# EAGLE design Artemis-Nano (EAGLE 9.4.0)

## Sheet 1 of 2
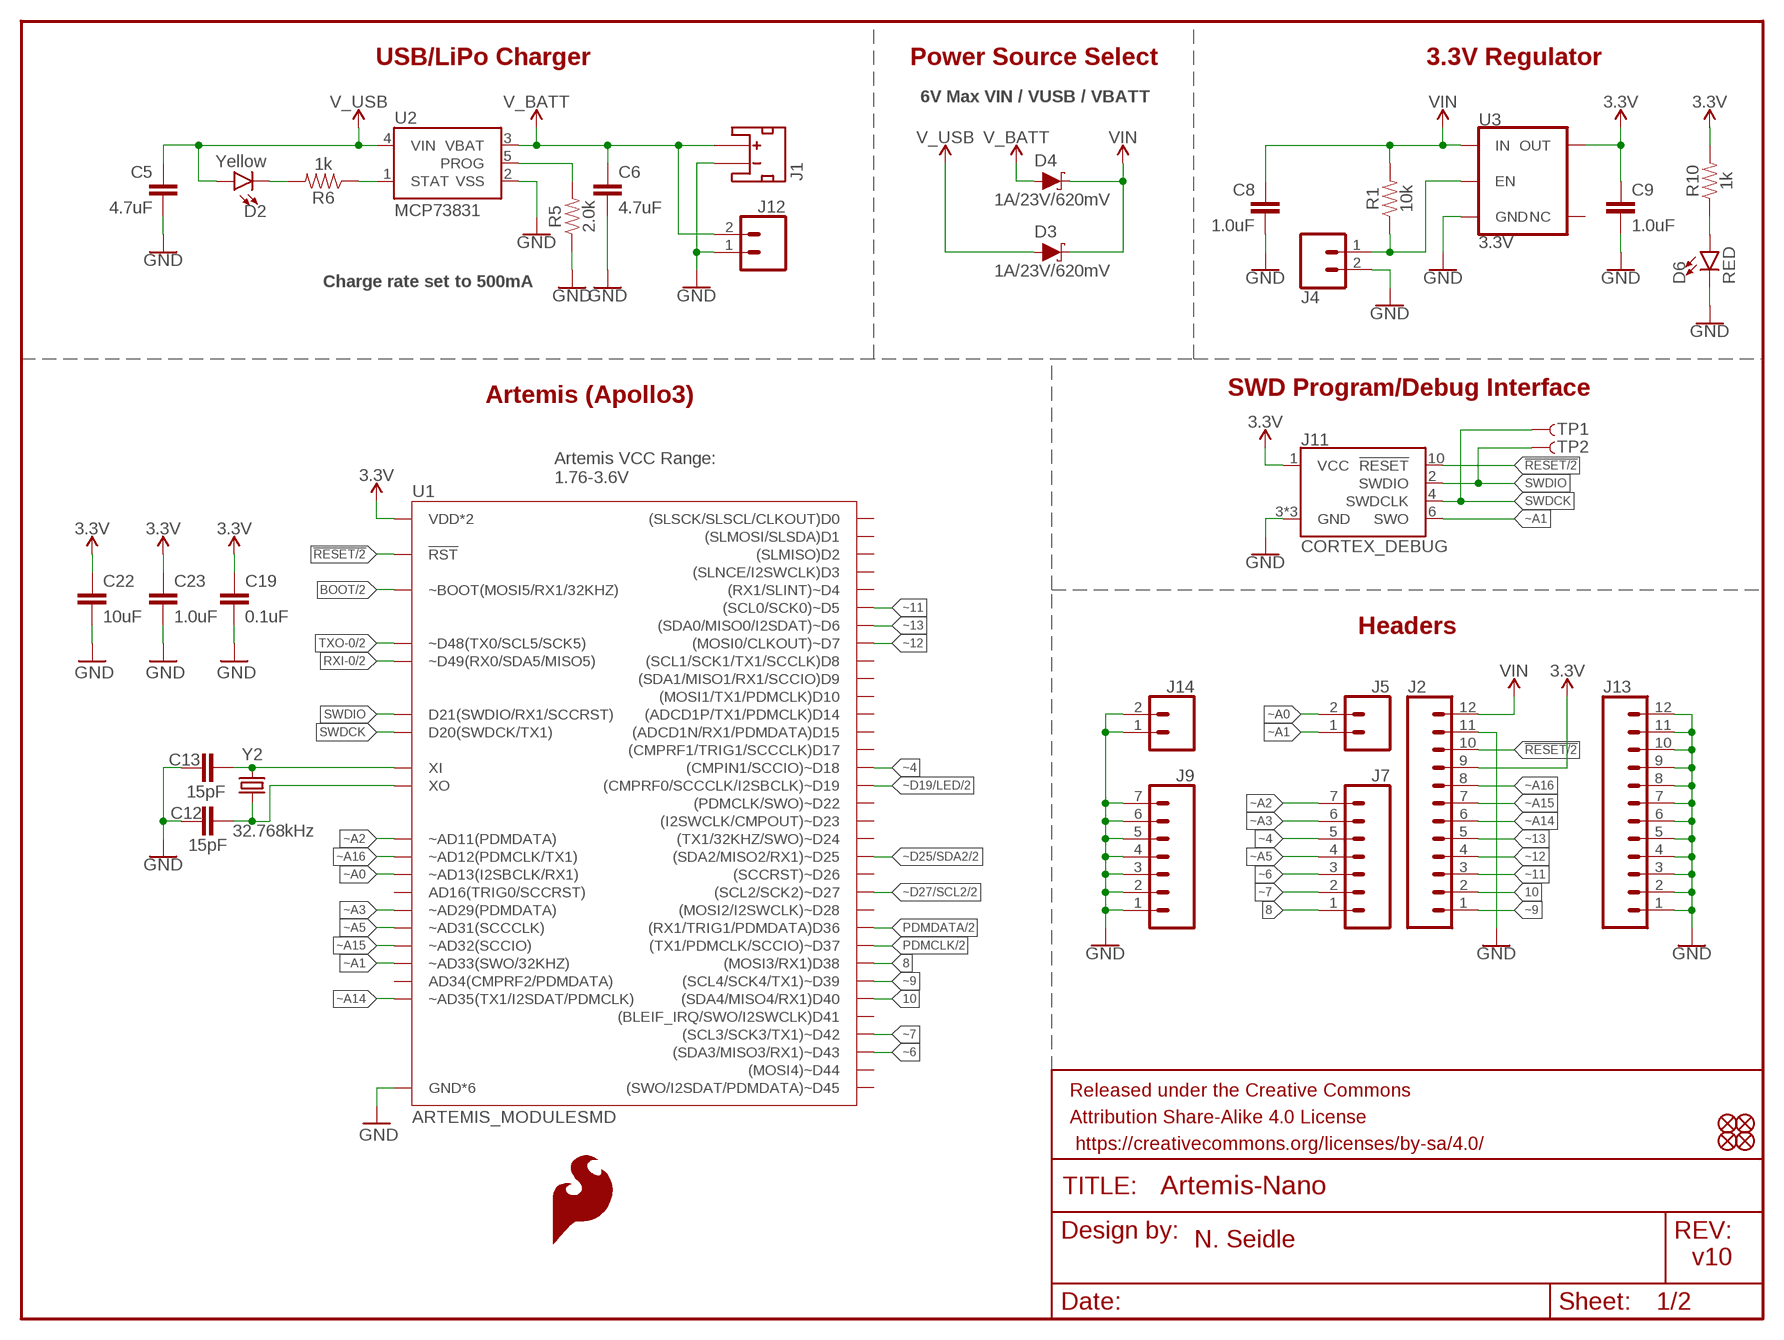
[diagram p0: schematic, sheet 1]

### Parts
C5  4.7uF  4.7UF-0603-6.3V-(10%)  [0603]
C6  4.7uF  4.7UF-0603-6.3V-(10%)  [0603]
C8  1.0uF  1.0UF-0402T-16V-10%  [0402-TIGHT]
C9  1.0uF  1.0UF-0402T-16V-10%  [0402-TIGHT]
C12  15pF  15PF-0603-50V-5%  [0603]
C13  15pF  15PF-0603-50V-5%  [0603]
C19  0.1uF  0.1UF-0402T-16V-10%  [0402-TIGHT]
C22  10uF  10UF-0603-6.3V-20%  [0603]
C23  1.0uF  1.0UF-0402T-16V-10%  [0402-TIGHT]
D2  Yellow  LED-YELLOW0603  [LED-0603]
D3  1A/23V/620mV  DIODE-SCHOTTKY-BAT20J  [SOD-323]
D4  1A/23V/620mV  DIODE-SCHOTTKY-BAT20J  [SOD-323]
D6  RED  LED-RED0603  [LED-0603]
FD1  FIDUCIALUFIDUCIAL  [FIDUCIAL-MICRO]
FD2  FIDUCIALUFIDUCIAL  [FIDUCIAL-MICRO]
FD3  FIDUCIALUFIDUCIAL  [FIDUCIAL-MICRO]
FD4  FIDUCIALUFIDUCIAL  [FIDUCIAL-MICRO]
FRAME1  FRAME-LETTER  [CREATIVE_COMMONS]
J1  JST_2MM_MALE  [JST-2-SMD]
J2  CONN_12NO_SILK  [1X12_NO_SILK]
J4  CONN_021X02_NO_SILK  [1X02_NO_SILK]
J5  CONN_021X02_NO_SILK  [1X02_NO_SILK]
J7  CONN_07NO_SILK  [1X07_NO_SILK]
J9  CONN_07NO_SILK  [1X07_NO_SILK]
J11  CORTEX_DEBUG  CORTEX_DEBUG_MINIMUM_PTH_NS  [2X5-PTH-1.27MM-NO_SILK]
J12  CONN_021X02_NO_SILK  [1X02_NO_SILK]
J13  CONN_12NO_SILK  [1X12_NO_SILK]
J14  CONN_021X02_NO_SILK  [1X02_NO_SILK]
LOGO1  SFE_LOGO_FLAME.1_INCH  [SFE_LOGO_FLAME_.1]
LOGO4  SFE_LOGO_FLAME.1_INCH  [SFE_LOGO_FLAME_.1]
R1  10k  10KOHM-0603-1/10W-1%  [0603]
R5  2.0k  2.0KOHM-0603-1/10W-5%  [0603]
R6  1k  1KOHM-0603-1/10W-1%  [0603]
R10  1k  1KOHM-0603-1/10W-1%  [0603]
TP1  TEST-POINT3X5  [PAD.03X.05]
TP2  TEST-POINT3X5  [PAD.03X.05]
U1  ARTEMIS_MODULESMD  [ARTEMIS_FP]
U2  MCP73831  [SOT23-5]
U3  3.3V  V_REG_AP2112K-3.3V  [SOT23-5]
Y2  32.768kHz  CRYSTAL-32.768KHZSMD-3.2X1.5  [CRYSTAL-SMD-3.2X1.5MM]

### Nets
3.3V: C9.1 C19.2 C22.1 C23.1 J2.9 J11.1(VCC) R10.2 U1.VDD@36(VDD*2) U1.VDD@37(VDD*2) U3.5(OUT) ; also sheet 2
8: J7.1 U1.D38((MOSI3/RX1)D38)
10: J2.2 U1.D40((SDA4/MISO4/RX1)D40)
!RESET: J2.10 J11.10(!RESET) U1.~RST(!RST) ; also sheet 2
BOOT: U1.BOOT(~BOOT(MOSI5/RX1/32KHZ)) ; also sheet 2
GND: C5.2 C6.2 C8.2 C9.2 C12.1 C13.1 C19.1 C22.2 C23.2 D6.C J1.1(-) J2.11 J4.2 J9.1 J9.2 J9.3 J9.4 J9.5 J9.6 J9.7 J11.3(GND) J11.5(GND) J11.9(GND) J12.1 J13.1 J13.2 J13.3 J13.4 J13.5 J13.6 J13.7 J13.8 J13.9 J13.10 J13.11 J13.12 J14.1 J14.2 R5.1 U1.GND@1(GND*6) U1.GND@22(GND*6) U1.GND@38(GND*6) U1.GND@39(GND*6) U1.GND@47(GND*6) U1.GND@59(GND*6) U2.2(VSS) U3.2(GND) ; also sheet 2
N$1: R5.2 U2.5(PROG)
N$2: C12.2 U1.XO Y2.P$2
N$3: D2.C R6.2
N$4: R6.1 U2.1(STAT)
N$8: C13.2 U1.XI Y2.P$1
N$10: D6.A R10.1
PDMCLK: U1.~D37((TX1/PDMCLK/SCCIO)~D37) ; also sheet 2
PDMDATA: U1.D36((RX1/TRIG1/PDMDATA)D36) ; also sheet 2
RXI-0: U1.RXI-0(~D49(RX0/SDA5/MISO5)) ; also sheet 2
SWDCK: J11.4(SWDCLK) TP1.P$1 U1.SWDCK(D20(SWDCK/TX1))
SWDIO: J11.2(SWDIO) TP2.P$1 U1.SWDIO(D21(SWDIO/RX1/SCCRST))
TXO-0: U1.TXO-0(~D48(TX0/SCL5/SCK5)) ; also sheet 2
V_BATT [power]: C6.1 D4.A J1.2(+) J12.2 U2.3(VBAT)
V_USB: C5.1 D2.A D3.A U2.4(VIN) ; also sheet 2
VIN: C8.1 D3.C D4.C J2.12 R1.2 U3.1(IN)
VREG_EN: J4.1 R1.1 U3.3(EN)
~4: J7.5 U1.~D18((CMPIN1/SCCIO)~D18)
~6: J7.3 U1.~D43((SDA3/MISO3/RX1)~D43)
~7: J7.2 U1.~D42((SCL3/SCK3/TX1)~D42)
~9: J2.1 U1.~D39((SCL4/SCK4/TX1)~D39)
~11: J2.3 U1.~D5((SCL0/SCK0)~D5)
~12: J2.4 U1.D7((MOSI0/CLKOUT)~D7)
~13: J2.5 U1.~D6((SDA0/MISO0/I2SDAT)~D6)
~A0: J5.2 U1.~AD13(~AD13(I2SBCLK/RX1))
~A1: J5.1 J11.6(SWO) U1.~AD33/SWO(~AD33(SWO/32KHZ))
~A2: J7.7 U1.~AD11(~AD11(PDMDATA))
~A3: J7.6 U1.~AD29(~AD29(PDMDATA))
~A5: J7.4 U1.~AD31(~AD31(SCCCLK))
~A14: J2.6 U1.~AD35(~AD35(TX1/I2SDAT/PDMCLK))
~A15: J2.7 U1.~AD32(~AD32(SCCIO))
~A16: J2.8 U1.~AD12(~AD12(PDMCLK/TX1))
~D19/LED: U1.~D19((CMPRF0/SCCCLK/I2SBCLK)~D19) ; also sheet 2
~D25/SDA2: U1.~D25((SDA2/MISO2/RX1)~D25) ; also sheet 2
~D27/SCL2: U1.~D27((SCL2/SCK2)~D27) ; also sheet 2
Unconnected: J1.NC1(PAD1) J1.NC2(PAD2) U1.AD16(AD16(TRIG0/SCCRST)) U1.AD34(AD34(CMPRF2/PDMDATA)) U1.D0((SLSCK/SLSCL/CLKOUT)D0) U1.D1((SLMOSI/SLSDA)D1) U1.D2((SLMISO)D2) U1.D3((SLNCE/I2SWCLK)D3) U1.D8((SCL1/SCK1/TX1/SCCLK)D8) U1.D9((SDA1/MISO1/RX1/SCCIO)D9) U1.D10((MOSI1/TX1/PDMCLK)D10) U1.D14((ADCD1P/TX1/PDMCLK)D14) U1.D15((ADCD1N/RX1/PDMDATA)D15) U1.D17((CMPRF1/TRIG1/SCCCLK)D17) U1.D41((BLEIF_IRQ/SWO/I2SWCLK)D41) U1.~D4((RX1/SLINT)~D4) U1.~D22((PDMCLK/SWO)~D22) U1.~D23((I2SWCLK/CMPOUT)~D23) U1.~D24((TX1/32KHZ/SWO)~D24) U1.~D26((SCCRST)~D26) U1.~D28((MOSI2/I2SWCLK)~D28) U1.~D44((MOSI4)~D44) U1.~D45((SWO/I2SDAT/PDMDATA)~D45) U3.4(NC)

### Notes on the sheet
- USB/LiPo Charger | Power Source Select | 3.3V Regulator
- 6V Max VIN / VUSB / VBATT
- Charge rate set to 500mA
- Artemis (Apollo3) | SWD Program/Debug Interface
- Artemis VCC Range:
  1.76-3.6V
- Headers
- N. Seidle
- v10

## Sheet 2 of 2
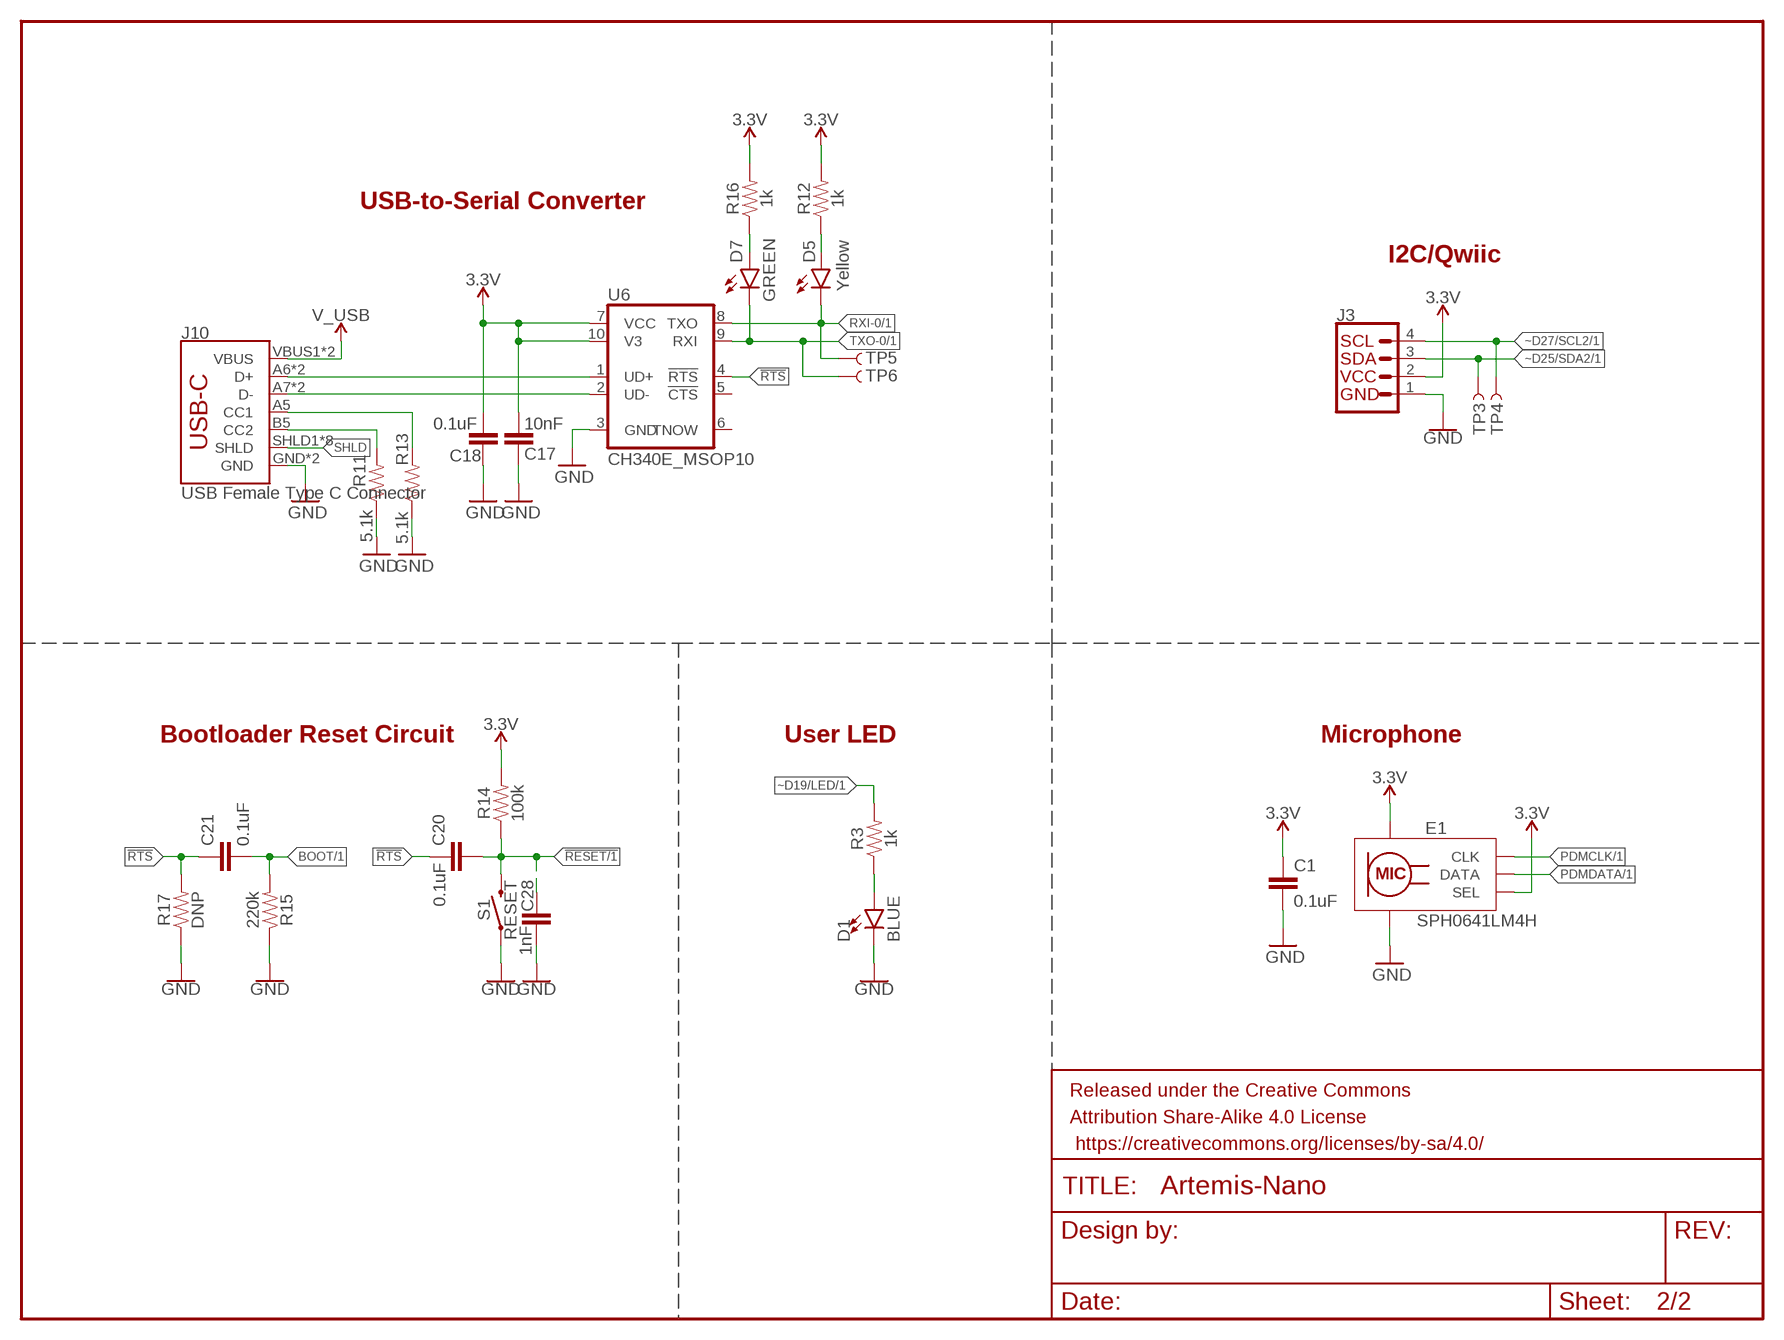
[diagram p1: schematic, sheet 2]

### Parts
C1  0.1uF  0.1UF-0402T-16V-10%  [0402-TIGHT]
C17  10nF  10NF-0603-50V-10%  [0603]
C18  0.1uF  0.1UF-0603-25V-(+80/-20%)  [0603]
C20  0.1uF  0.1UF-0603-25V-5%  [0603]
C21  0.1uF  0.1UF-0603-25V-5%  [0603]
C28  1nF  1.0NF/1000PF-0603-50V-10%  [0603]
D1  BLUE  LED-BLUE0603  [LED-0603]
D5  Yellow  LED-YELLOW0603  [LED-0603]
D7  GREEN  LED-GREEN0603  [LED-0603]
E1  SPH0641LM4H  SPH0641LM4H-1_MICROPHONE  [SPH0641LM4H-1_MICROPHONE]
FRAME2  FRAME-LETTERNO_PACKAGE  [DUMMY]
J3  QWIIC_CONNECTORJS-1MM  [JST04_1MM_RA]
J10  USB Female Type C Connector  USB_C4-LAYER-ISOLATED  [USB-C-16P-4LAYER-ISOLATED]
R3  1k  1KOHM-0603-1/10W-1%  [0603]
R11  5.1k  5.1KOHM5.1KOHM-0603-1/10W-1%  [0603]
R12  1k  1KOHM-0603-1/10W-1%  [0603]
R13  5.1k  5.1KOHM5.1KOHM-0603-1/10W-1%  [0603]
R14  100k  100KOHM-0603-1/10W-1%  [0603]
R15  220k  220KOHM-0603-1/10W-1%  [0603]
R16  1k  1KOHM-0603-1/10W-1%  [0603]
R17  DNP  RESISTOR0603  [0603]
S1  RESET  MOMENTARY-SWITCH-SPST-SMD-4.6X2.8MM  [TACTILE_SWITCH_SMD_4.6X2.8MM]
TP3  TEST-POINT3X5  [PAD.03X.05]
TP4  TEST-POINT3X5  [PAD.03X.05]
TP5  TEST-POINT3X5  [PAD.03X.05]
TP6  TEST-POINT3X5  [PAD.03X.05]
U6  CH340E_MSOP10  [MSOP10]

### Nets
3.3V: C1.1 C17.1 C18.1 E1.2(SEL) E1.5(VDD) J3.2 R12.2 R14.2 R16.2 U6.7(VCC) U6.10(V3) ; also sheet 1
!RESET: C20.2 C28.1 R14.1 S1.3 S1.4 ; also sheet 1
!RTS: C20.1 C21.1 R17.2 U6.4(!RTS)
BOOT: C21.2 R15.2 ; also sheet 1
CC1: J10.A5(CC1) R13.2
CC2: J10.B5(CC2) R11.2
D+1: J10.A6(D+) J10.B6(D+) U6.1(UD+)
D-1: J10.A7(D-) J10.B7(D-) U6.2(UD-)
GND: C1.2 C17.2 C18.2 C28.2 D1.C E1.3(GND) E1.6(GND) E1.7(GND) E1.8(GND) J3.1 J10.GND J10.GND2(GND) R11.1 R13.1 R15.1 R17.1 S1.1 S1.2 U6.3(GND) ; also sheet 1
N$5: D7.A R16.1
N$7: D1.A R3.1
N$9: D5.A R12.1
PDMCLK: E1.4(CLK) ; also sheet 1
PDMDATA: E1.1(DATA) ; also sheet 1
RXI-0: D5.C TP5.P$1 U6.8(TXO) ; also sheet 1
SHLD: J10.SHLD1(SHLD) J10.SHLD2(SHLD) J10.SHLD3(SHLD) J10.SHLD4(SHLD) J10.SHLD5(SHLD) J10.SHLD6(SHLD) J10.SHLD7(SHLD) J10.SHLD8(SHLD)
TXO-0: D7.C TP6.P$1 U6.9(RXI) ; also sheet 1
V_USB: J10.VBUS1(VBUS) J10.VBUS2(VBUS) ; also sheet 1
~D19/LED: R3.2 ; also sheet 1
~D25/SDA2: J3.3 TP3.P$1 ; also sheet 1
~D27/SCL2: J3.4 TP4.P$1 ; also sheet 1
Unconnected: U6.5(!CTS) U6.6(TNOW)

### Notes on the sheet
- USB-to-Serial Converter
- I2C/Qwiic
- Bootloader Reset Circuit | User LED | Microphone

## Library data of the parts
C1 C19 = SparkFun-Capacitors:0.1UF: 0.1µF ceramic capacitors A capacitor is a passive two-terminal electrical component used to store electrical energy temporarily in an electric field.; PROD_ID: CAP-12416
C5 C6 = SparkFun-Capacitors:4.7UF: 4.7µF ceramic capacitors A capacitor is a passive two-terminal electrical component used to store electrical energy temporarily in an electric field.; PROD_ID: CAP-08280
C8 C9 C23 = SparkFun-Capacitors:1.0UF: 1µF ceramic capacitors A capacitor is a passive two-terminal electrical component used to store electrical energy temporarily in an electric field.; PROD_ID: CAP-12417
C12 C13 = SparkFun-Capacitors:15PF: 15pF ceramic capacitors A capacitor is a passive two-terminal electrical component used to store electrical energy temporarily in an electric field.; PROD_ID: CAP-07881
C17 = SparkFun-Capacitors:10NF: 0.01uF/10nF/10,000pF ceramic capacitors A capacitor is a passive two-terminal electrical component used to store electrical energy temporarily in an electric field. CAP-09321; PROD_ID: CAP-00867
C18 = SparkFun-Capacitors:0.1UF: 0.1µF ceramic capacitors A capacitor is a passive two-terminal electrical component used to store electrical energy temporarily in an electric field.; PROD_ID: CAP-00810
C20 C21 = SparkFun-Capacitors:0.1UF: 0.1µF ceramic capacitors A capacitor is a passive two-terminal electrical component used to store electrical energy temporarily in an electric field.; PROD_ID: CAP-08604
C22 = SparkFun-Capacitors:10UF: 10.0µF ceramic capacitors A capacitor is a passive two-terminal electrical component used to store electrical energy temporarily in an electric field.; PROD_ID: CAP-11015
C28 = SparkFun-Capacitors:1.0NF/1000PF: 1nF/1,000pF ceramic capacitors A capacitor is a passive two-terminal electrical component used to store electrical energy temporarily in an electric field.; PROD_ID: CAP-07886
D1 = SparkFun-LED:LED-BLUE: Blue SMD LED Used in manufacturing of various products at SparkFun Packages: 0603 - SMD 0603 package [Product Link] <http://www.digikey.com/product-detail/en/SMLE12BC7TT86/511-1589-2-ND/1641808> 1206 - SMD1206 package [Product Link] <http://www.digikey.com/product-detail/en/lite-on-inc/LTST-C150TBKT/160-1643-1-ND/573584> SparkFun Products: ESP8266 Thing-Dev Board <https://www.sparkfun.com/products/13711> RedBoard <https://www.sparkfun.com/products/12757>; PROD_ID: DIO-08575
D2 D5 = SparkFun-LED:LED-YELLOW: Yellow SMD LED Used in manufacturing several products at SparkFun. Packages: 0603 - SMD 0603 package[Product Link] <http://www.kingbrightusa.com/product.asp?catalog_name=LED&product_id=APT1608SYCK> 0603 -SMART - SMART SMD 0603 package (more efficient/more expensive) [Product Link] <http://www.osram-os.com/osram_os/en/products/product-catalog/led-light-emitting-diodes/smartled-0603/ly-l29k/index.jsp> LilyPad - SMD1206 package[Product Datasheet] <https://www.sparkfun.com/datasheets/DevTools/LilyPad/Q150YUS4.pdf> SparkFun Products: Blynk Board <https://www.sparkfun.com/products/13794> IOIO-OTG <https://www.sparkfun.com/products/13613> XBee Explorer Serial <https://www.sparkfun.com/products/13225>; PROD_ID: DIO-09003
D3 D4 = SparkFun-DiscreteSemi:DIODE-SCHOTTKY: Schottky diode A Schottky diode is a semiconductor diode which has a low forward voltage drop and a very fast switching action.; PROD_ID: DIO-11623
D6 = SparkFun-LED:LED-RED: Red SMD LED Used in manufacturing of most products at SparkFun Packages: 0603 - SMD 0603 package [Product Link] <http://docs.avagotech.com/docs/AV02-0551EN> 0603 SMART - SMD 0603 SMART package ( more efficient and expensive)[Product Link] <http://www.osram-os.com/Graphics/XPic2/00077099_0.pdf> 1206 - SMD1206 package [Product Link] <https://www.sparkfun.com/datasheets/DevTools/LilyPad/Q150OVS4.pdff> SparkFun Products: Pro Mini 328 -5V <https://www.sparkfun.com/products/821> RedBoard <https://www.sparkfun.com/products/12757> IOIO-OTG <https://www.sparkfun.com/products/13613>; PROD_ID: DIO-00819
D7 = SparkFun-LED:LED-GREEN: Green SMD LED Used in manufacturing of various products at SparkFun Packages: 0603 - SMD 0603 package [Product Link] <http://www.futureelectronics.com/en/technologies/semiconductors/optoelectronics/leds/Pages/9894312-LTST-C190GKT.aspx?CrossPart=HSMG-C190&IM=0> LilyPad 1206 - SMD1206 LilyPad package [Product Link] <http://www.futureelectronics.com/en/Technologies/Product.aspx?ProductID=IN150NGHARVATEKCORPORATION2049943&IM=0> 1206 - SMD1206 package [Product Link] <http://www.futureelectronics.com/en/technologies/semiconductors/optoelectronics/leds/Pages/8315665-LTST-C150KGKT.aspx?IM=0> 1206 Bottom Mount -SMD 1206 Bottom Mount [Product Link] <http://www.digikey.com/product-detail/en/lite-on-inc/LTST-C230KGKT/160-1456-1-ND/386854> SparkFun Products: Pro Mini 328 -5V <https://www.sparkfun.com/products/821> RedBoard <https://www.sparkfun.com/products/12757> MP3 Trigger <https://www.sparkfun.com/products/13720> Makey Makey <https://www.sparkfun.com/products/11076>; PROD_ID: DIO-00821
E1 = SparkFun-Sensors:SPH0641LM4H-1_MICROPHONE: SPH0641LM4H-1 Microphone A miniature, high-performance, low power, bottom port silicon digital microphone with a single bit PDM output.; PROD_ID: IC-14361; VALUE: SPH0641LM4H-1
FD1-FD4 = SparkFun-Aesthetics:FIDUCIAL: Fiducial Alignment Points Point-of-reference for pick-and-place machines and other optical instruments.
FRAME1 = SparkFun-Aesthetics:FRAME-LETTER: Schematic Frame - Letter Standard 8.5x11 US Letter frame
FRAME2 = SparkFun-Aesthetics:FRAME-LETTER: Schematic Frame - Letter Standard 8.5x11 US Letter frame; DESIGNER: Nobody; VERSION: v01
J1 = SparkFun-Connectors:JST_2MM_MALE: JST 2MM MALE RA CONNECTOR Two pin, compact surface mount connector. Commonly used as a battery input connection point. We really like the solid locking feeling and high current rating on these small connectors. We use these all the time as battery connectors. Mates to single-cell LiPo batteries. Here is the connector we sell at SparkFun: JST Right Angle Connector - White <https://www.sparkfun.com/products/8612> (PRT-08612) Datasheet <http://www.sparkfun.com/datasheets/Prototyping/Connectors/JST-Horizontal.pdf> It was used on these SparkFun products: SparkFun MOSFET Power Controller <https://www.sparkfun.com/products/11214> (PRT-11214) SparkFun Battery Babysitter - LiPo Battery Manager <https://www.sparkfun.com/products/13777> (PRT-13777) And many, many others that required a lipo battery connection.; PROD_ID: CONN-11443; SF_ID: PRT-08612
J2 J13 = SparkFun-Connectors:CONN_12: Multi connection point. Often used as Generic Header-pin footprint for 0.1 inch spaced/style header connections On any of the 0.1 inch spaced packages, you can populate with these: Break Away Headers - Straight <https://www.sparkfun.com/products/116> (PRT-00116) Break Away Male Headers - Right Angle <https://www.sparkfun.com/products/553> (PRT-00553) Female Headers <https://www.sparkfun.com/products/115> (PRT-00115) Break Away Headers - Machine Pin <https://www.sparkfun.com/products/117> (PRT-00117) Break Away Female Headers - Swiss Machine Pin <https://www.sparkfun.com/products/743> (PRT-00743) For SCREWTERMINALS and SPRING TERMINALS visit here: Screw Terimnals on SparkFun.com <https://www.sparkfun.com/search/results?term=Screw+Terminals> (5mm/3.5mm/2.54mm spacing) This device is also useful as a general connection point to wire up your design to another part of your project. Our various solder wires solder well into these plated through hole pads. Hook-Up Wire - Assortment (Stranded, 22 AWG) <https://www.sparkfun.com/products/11375> (PRT-11375) Hook-Up Wire - Assortment (Solid Core, 22 AWG) <https://www.sparkfun.com/products/11367> (PRT-11367) View the entire wire category on our website here <https://www.sparkfun.com/categories/141> Special notes: Molex polarized connector foot print use with SKU : PRT-08231 with associated crimp pins and housings. 1MM SMD Version SKU: PRT-10208 NOTES ON THE VARIANTS LOCK and LOCK_LONGPADS... This footprint was designed to help hold the alignment of a through-hole component (i.e. 6-pin header) while soldering it into place. You may notice that each hole has been shifted either up or down by 0.005 of an inch from it's more standard position (which is a perfectly straight line). This slight alteration caused the pins (the squares in the middle) to touch the edges of the holes. Because they are alternating, it causes a "brace" to hold the component in place. 0.005 has proven to be the perfect amount of "off-center" position when using our standard breakaway headers. Although looks a little odd when you look at the bare footprint, once you have a header in there, the alteration is very hard to notice. Also,if you push a header all the way into place, it is covered up entirely on the bottom side.
J3 = SparkFun-Connectors:QWIIC_CONNECTOR: SparkFun I2C Standard Qwiic Connector An SMD 1mm pitch JST connector makes it easy and quick (get it? Qwiic?) to connect I2C devices to each other. The Qwiic system <http://www.sparkfun.com/qwiic> enables fast and solderless connection between popular platforms and various sensors and actuators. We carry 200mm <https://www.sparkfun.com/products/14204>, 100mm <https://www.sparkfun.com/products/14205>, 50mm <https://www.sparkfun.com/products/14206>, and breadboard friendly <https://www.sparkfun.com/products/14207> Qwiic cables. We also offer 10 pcs strips <https://www.sparkfun.com/products/14323> the SMD connectors.; PROD_ID: CONN-13694
J4 J5 J12 J14 = SparkFun-Connectors:CONN_02: Multi connection point. Often used as Generic Header-pin footprint for 0.1 inch spaced/style header connections On any of the 0.1 inch spaced packages, you can populate with these: Break Away Headers - Straight <https://www.sparkfun.com/products/116> (PRT-00116) Break Away Male Headers - Right Angle <https://www.sparkfun.com/products/553> (PRT-00553) Female Headers <https://www.sparkfun.com/products/115> (PRT-00115) Break Away Headers - Machine Pin <https://www.sparkfun.com/products/117> (PRT-00117) Break Away Female Headers - Swiss Machine Pin <https://www.sparkfun.com/products/743> (PRT-00743) For SCREWTERMINALS and SPRING TERMINALS visit here: Screw Terimnals on SparkFun.com <https://www.sparkfun.com/search/results?term=Screw+Terminals> (5mm/3.5mm/2.54mm spacing) This device is also useful as a general connection point to wire up your design to another part of your project. Our various solder wires solder well into these plated through hole pads. Hook-Up Wire - Assortment (Stranded, 22 AWG) <https://www.sparkfun.com/products/11375> (PRT-11375) Hook-Up Wire - Assortment (Solid Core, 22 AWG) <https://www.sparkfun.com/products/11367> (PRT-11367) View the entire wire category on our website here <https://www.sparkfun.com/categories/141> Special notes: Molex polarized connector foot print use with: PRT-08233 with associated crimp pins and housings. 2.54_SCREWTERM for use with PRT-10571. 3.5mm Screw Terminal footprints for PRT-08084 5mm Screw Terminal footprints for use with PRT-08432
J7 J9 = SparkFun-Connectors:CONN_07: Multi connection point. Often used as Generic Header-pin footprint for 0.1 inch spaced/style header connections On any of the 0.1 inch spaced packages, you can populate with these: Break Away Headers - Straight <https://www.sparkfun.com/products/116> (PRT-00116) Break Away Male Headers - Right Angle <https://www.sparkfun.com/products/553> (PRT-00553) Female Headers <https://www.sparkfun.com/products/115> (PRT-00115) Break Away Headers - Machine Pin <https://www.sparkfun.com/products/117> (PRT-00117) Break Away Female Headers - Swiss Machine Pin <https://www.sparkfun.com/products/743> (PRT-00743) For SCREWTERMINALS and SPRING TERMINALS visit here: Screw Terimnals on SparkFun.com <https://www.sparkfun.com/search/results?term=Screw+Terminals> (5mm/3.5mm/2.54mm spacing) This device is also useful as a general connection point to wire up your design to another part of your project. Our various solder wires solder well into these plated through hole pads. Hook-Up Wire - Assortment (Stranded, 22 AWG) <https://www.sparkfun.com/products/11375> (PRT-11375) Hook-Up Wire - Assortment (Solid Core, 22 AWG) <https://www.sparkfun.com/products/11367> (PRT-11367) View the entire wire category on our website here <https://www.sparkfun.com/categories/141> Special notes: Molex polarized connector foot print use with SKU : PRT-08231 with associated crimp pins and housings. 1MM SMD Version SKU: PRT-10208 NOTES ON THE VARIANTS LOCK and LOCK_LONGPADS... This footprint was designed to help hold the alignment of a through-hole component (i.e. 6-pin header) while soldering it into place. You may notice that each hole has been shifted either up or down by 0.005 of an inch from it's more standard position (which is a perfectly straight line). This slight alteration caused the pins (the squares in the middle) to touch the edges of the holes. Because they are alternating, it causes a "brace" to hold the component in place. 0.005 has proven to be the perfect amount of "off-center" position when using our standard breakaway headers. Although looks a little odd when you look at the bare footprint, once you have a header in there, the alteration is very hard to notice. Also,if you push a header all the way into place, it is covered up entirely on the bottom side.
J10 = SparkFun-Connectors:USB_C: USB Type C 16Pin Connector Super Speed pins not available on the 16-pin purely SMD connector so this part is best for USB 2.0 implementations. D1 and D2 are tied together enabling D+/- no matter which way the cable is plugged into the connector. The two channel configuration pins (CC1/2) are exposed. These are normally connected to ground via 5.1k resistors but can be reconfigured for high current/high power applications.; PROD_ID: CONN-14122
J11 = SparkFun-Connectors:CORTEX_DEBUG_MINIMUM: Cortex Debug Connector - 10 pin Supports JTAG debug, Serial Wire debug, and Serial Wire Viewer. PTH and SMD connector options available. General Connector Information <http://infocenter.arm.com/help/topic/com.arm.doc.faqs/attached/13634/cortex_debug_connectors.pdf> Products: PTH Connector <http://www.digikey.com/product-detail/en/cnc-tech/3220-10-0100-00/1175-1627-ND/3883661> -via Digi-Key SparkFun PSoc <https://www.sparkfun.com/products/13229> SparkFun T <https://www.sparkfun.com/products/13810>
LOGO1 LOGO4 = SparkFun-Aesthetics:SFE_LOGO_FLAME: SparkFun Flame Logo This is the SparkFun flame logo. The logo on the schematic will always be the same size; the package variant is the height of the flame. Default layer for the logo on the board is tSilk.
R1 = SparkFun-Resistors:10KOHM: 10kΩ resistor A resistor is a passive two-terminal electrical component that implements electrical resistance as a circuit element. Resistors act to reduce current flow, and, at the same time, act to lower voltage levels within circuits. - Wikipedia; PROD_ID: RES-00824
R3 R6 R10 R12 R16 = SparkFun-Resistors:1KOHM: 1kΩ resistor A resistor is a passive two-terminal electrical component that implements electrical resistance as a circuit element. Resistors act to reduce current flow, and, at the same time, act to lower voltage levels within circuits. - Wikipedia; PROD_ID: RES-07856
R5 = SparkFun-Resistors:2.0KOHM: 2kΩ resistor A resistor is a passive two-terminal electrical component that implements electrical resistance as a circuit element. Resistors act to reduce current flow, and, at the same time, act to lower voltage levels within circuits. - Wikipedia; PROD_ID: RES-08296
R11 R13 = SparkFun-Resistors:5.1KOHM; PROD_ID: RES-12083
R14 = SparkFun-Resistors:100KOHM: 100kΩ resistor A resistor is a passive two-terminal electrical component that implements electrical resistance as a circuit element. Resistors act to reduce current flow, and, at the same time, act to lower voltage levels within circuits. - Wikipedia; PROD_ID: RES-07828
R15 = SparkFun-Resistors:220KOHM: 220kΩ resistor A resistor is a passive two-terminal electrical component that implements electrical resistance as a circuit element. Resistors act to reduce current flow, and, at the same time, act to lower voltage levels within circuits. - Wikipedia; PROD_ID: RES-08969
R17 = SparkFun-Resistors:RESISTOR: Generic Resistor Package
S1 = SparkFun-Switches:MOMENTARY-SWITCH-SPST: Momentary Switch (Pushbutton) - SPST Normally-open (NO) SPST momentary switches (buttons, pushbuttons). Variants PTH-12MM - 12mm square, through-hole Momentary Pushbutton Switch - 12mm Square <https://www.sparkfun.com/products/9190> (COM-09190) PTH-6.0MM, PTH-6.0MM-KIT - 6.0mm square, through-hole Mini Pushbutton Switch <https://www.sparkfun.com/products/97> (COM-00097) KIT package intended for soldering kit's - only one side of pads' copper is exposed. PTH-RIGHT-ANGLE-KIT - Right-angle, through-hole Right Angle Tactile Button <https://www.sparkfun.com/products/10791> - Used on SparkFun BigTime Watch Kit <https://www.sparkfun.com/products/11734> SMD-12MM - 12mm square, surface-mount Tactile Button - SMD (12mm) <https://www.sparkfun.com/products/12993> (COM-12993) Used on SparkFun PicoBoard <https://www.sparkfun.com/products/11888> SMD-4.5MM - 4.5mm Square Trackball Switch Used on SparkFun Blackberry Trackballer Breakout <https://www.sparkfun.com/products/13169> SMD-4.6MMX2.8MM - 4.60mm x 2.80mm, surface mount Used on SparkFun SAMD21 Mini Breakout <https://www.sparkfun.com/products/13664> SMD-5.2MM, SMD-5.2-REDUNDANT - 5.2mm square, surface-mount Mini Pushbutton Switch - SMD <https://www.sparkfun.com/products/8720> (COM-08720) Used on Arduino Pro Mini <https://www.sparkfun.com/products/11114> REDUNDANT package connects both switch circuits together SMD-6.0X3.5MM - 6.0 x 3.5mm, surface mount Momentary Reset Switch SMD <https://www.sparkfun.com/products/8229> (COM-08229) SMD-6.2MM-TALL - 6.2mm square, surface mount Tactile Button - SMD (6mm) <https://www.sparkfun.com/products/12992> Used on SparkFun Digital Sandbox <https://www.sparkfun.com/products/12651> SMD-RIGHT-ANGLE - Right-angle, surface mount Used on SparkFun Block for Intel® Edison - Arduino <https://www.sparkfun.com/products/13036>; PROD_ID: SWCH-13065
TP1-TP6 = SparkFun-Connectors:TEST-POINT: SparkFun Test Points Bare copper test points for troubleshooting or In-Circuit-Testing. These are used by our Production team for verifying production board runs using pogo-pins on test beds. SparkFun Products: SparkFun LSM9DS1 Breakout <https://www.sparkfun.com/products/13284> SparkFun PSOC <https://www.sparkfun.com/products/13714> SparkFun Load Cell Amplifier <https://www.sparkfun.com/products/13879>
U1 = Testing:ARTEMIS_MODULE
U2 = SparkFun-IC-Power:MCP73831: MCP73831T Li-Ion, Li-Pol Controller Miniature single cell, fully integrated Li-Ion, Li-polymer charge management controller Datasheet <http://ww1.microchip.com/downloads/en/DeviceDoc/20001984g.pdf> SparkFun Products: SparkFun ESP32 Thing <https://www.sparkfun.com/products/13907> SparkFun 9DoF Razor IMU M0 <https://www.sparkfun.com/products/14001>; PROD_ID: IC-09995
U3 = SparkFun-IC-Power:V_REG_AP2112: AP2112 - 600mA CMOS LDO Regulator w/ Enable The AP2112 is CMOS process low dropout linear regulator with enable function, the regulator delivers a guaranteed 600mA (min.) continuous load current. Features Output Voltage Accuracy: ±1.5% Output Current: 600mA (Min.) Foldback Short Current Protection: 50mA Enable Function to Turn ON/OFF VOUT Low Dropout Voltage (3.3V): 250mV (Typ.) @IOUT=600mA Excellent Load Regulation: 0.2%/A (Typ.) Excellent Line Regulation: 0.02%/V (Typ.) Low Quiescent Current: 55μA (Typ.) Low Standby Current: 0.01μA (Typ.) Low Output Noise: 50μVRMS PSRR: 100Hz -65dB, 1kHz -65dB OTSD Protection Stable with 1.0μF Flexible Cap: Ceramic, Tantalum and Aluminum Electrolytic Operation Temperature Range: -40°C to 85°C ESD: MM 400V, HBM 4000V; PROD_ID: VREG-12457
U6 = SparkFun-IC-Comms:CH340E; PROD_ID: IC-14135
Y2 = SparkFun-Clocks:CRYSTAL-32.768KHZ: 32.768kHz Crystal Frequency: 32.768kHz Frequency Stability: ±20ppm Load Capacitance: 12.5pF (PTH-2X6 & SMD-3.2X1.5), 6pF (SMD-2X6) SparkFun Products: SparkFun BigTime Watch Kit <https://www.sparkfun.com/products/11734> SparkFun nRF52832 Breakout <https://www.sparkfun.com/products/13990> SparkFun Real Time Clock Module <https://www.sparkfun.com/products/12708>; PROD_ID: XTAL-13062

## Net classes
0 default: width 0 mm, drill 0 mm
1 power: width 0.762 mm
2 usb: width 0.254 mm, drill 0.305 mm, clearance 0.254 mm

## Board
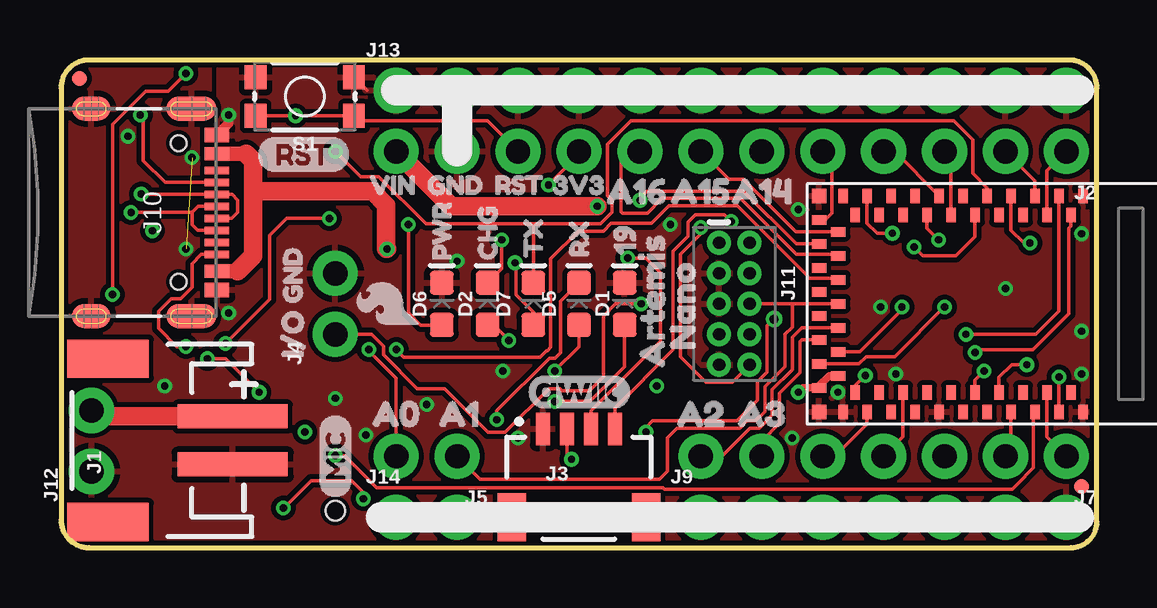
[diagram p2: board, top side]
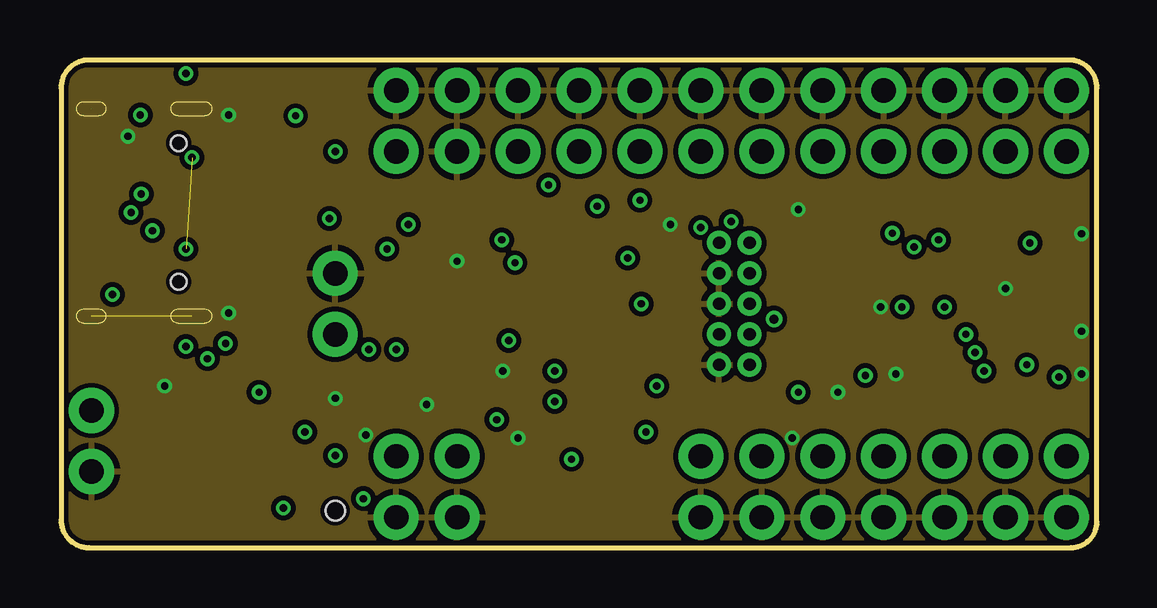
[diagram p3: board, inner layer Route2]
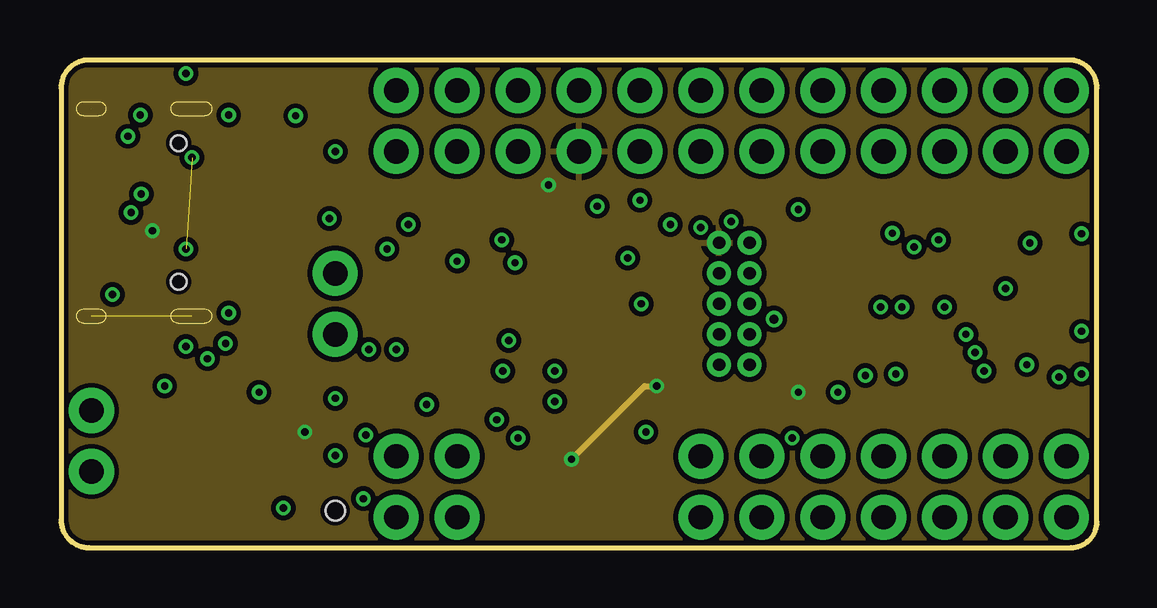
[diagram p4: board, inner layer Route15]
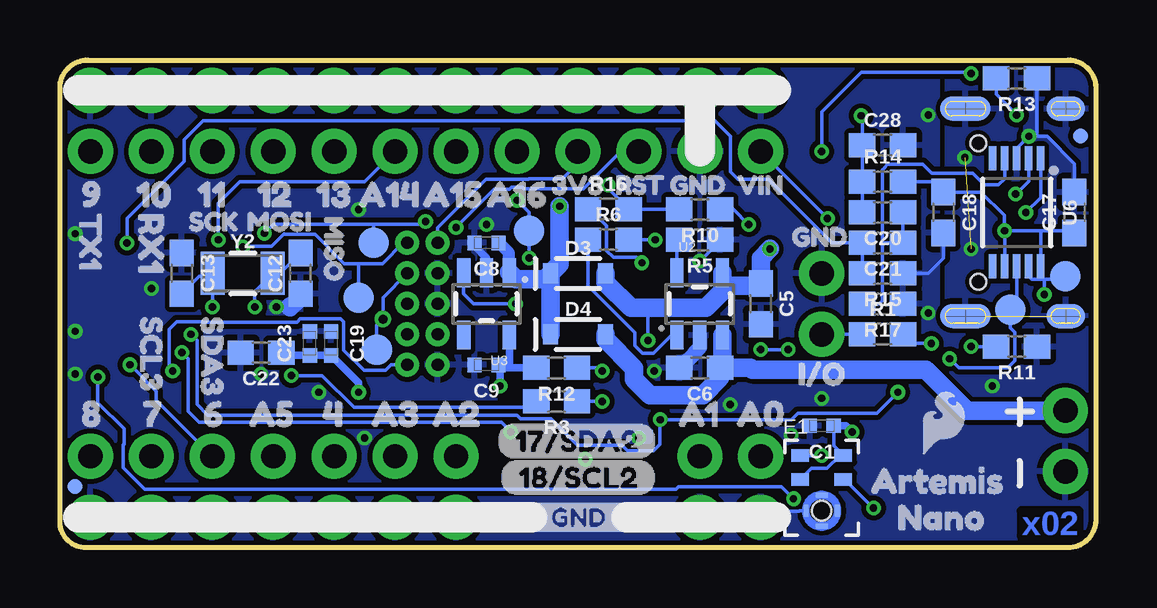
[diagram p5: board, bottom side, seen from below]

Size 43.18 x 20.32 mm. Coordinates in mm from the lower left corner, seen from the top.
Outline: 42.1,0 arc90 43.18,1.07 43.18,19.16 arc90 42.02,20.32 1.16,20.32 arc90 0,19.16 0,1.16 arc90 1.16,0 42.1,0
Copper layers (1*2*15*16): Top 0.035559375mm / dielectric 0.47751875mm / Route2 0.035559375mm / dielectric 0.47751875mm / Route15 0.035559375mm / dielectric 0.47751875mm / Bottom 0.035559375mm
Design rules "SparkFun-4-layer-TIGHT *": minimum track width 6mil, minimum drill 12mil, track to track 6mil, track to pad 6mil, pad to pad 6mil, via to via 6mil, smd to smd 6mil, copper to edge 6mil, drill to drill 6mil, minimum pad ring 6mil, minimum via ring 6mil, stop-mask expansion 4mil, vias tented up to drill 25mil, thermal gap 10mil

### Footprints (pad centres in the part's own frame; a part is rotated, then mirrored left to right if it is on the bottom)
0402-TIGHT = smd 0.6 x 0.6: 1 -0.5,0; 2 0.5,0
0603 = smd 1.1 x 1: 1 -0.85,0; 2 0.85,0
LED-0603 = smd 1 x 1: A -0.877,0; C 0.877,0
SOD-323 = smd 0.63 x 0.83: A 1.15,0; C -1.15,0
SPH0641LM4H-1_MICROPHONE = smd 0.725 x 0.522: 1 -0.9,1.3; 2 -0.9,0.3; 4 0.9,0.3; 5 0.9,1.3 | smd 0.5 x 0.2: 3 0,-1.65; 8 0,-0.35 | smd 0.2 x 0.5: 6 -0.65,-1; 7 0.65,-1 | hole 0.8: 0,-1
FIDUCIAL-MICRO = smd 0.635 x 0.635: 1 0,0
JST-2-SMD = smd 1 x 4.6: 1 -1,-3.7; 2 1,-3.7 | smd 1.6 x 3.4: NC1 -3.4,1.5; NC2 3.4,1.5
1X12_NO_SILK = drill 1.016 pad 1.88: 1 0,0; 2 2.54,0; 3 5.08,0; 4 7.62,0; 5 10.16,0; 6 12.7,0; 7 15.24,0; 8 17.78,0; 9 20.32,0; 10 22.86,0; 11 25.4,0; 12 27.94,0
JST04_1MM_RA = smd 0.6 x 1.35: 1 -1.5,0; 2 -0.5,0; 3 0.5,0; 4 1.5,0 | smd 1.2 x 2: NC1 2.8,-3.675; NC2 -2.8,-3.675
1X02_NO_SILK = drill 1.016 pad 1.88: 1 0,0; 2 2.54,0
1X07_NO_SILK = drill 1.016 pad 1.88: 1 0,0; 2 2.54,0; 3 5.08,0; 4 7.62,0; 5 10.16,0; 6 12.7,0; 7 15.24,0
USB-C-16P-4LAYER-ISOLATED = smd 0.3 x 1.016: A5 -1.25,0.154; A6 -0.25,0.154; A7 0.25,0.154; A8 1.25,0.154; B5 1.75,0.154; B6 0.75,0.154; B7 -0.75,0.154; B8 -1.75,0.154 | smd 0.6 x 1.016: GND -3.225,0.154; GND2 3.225,0.154 | smd 1 x 2.1: SHLD1 -4.32,-0.915; SHLD2 4.32,-0.915 | smd 1 x 2.1 bottom: SHLD3 -4.32,-0.915; SHLD4 4.32,-0.915 | smd 1 x 1.6: SHLD5 -4.32,-5.095; SHLD8 4.32,-5.095 | smd 1 x 1.6 bottom: SHLD6 -4.32,-5.095; SHLD7 4.32,-5.095 | smd 0.55 x 1.016: VBUS1 -2.45,0.154; VBUS2 2.45,0.154 | hole 0.65: -2.89,-1.445; 2.89,-1.445
2X5-PTH-1.27MM-NO_SILK = drill 0.508 pad 1: 1 -2.54,-0.635; 2 -2.54,0.635; 3 -1.27,-0.635; 4 -1.27,0.635; 5 0,-0.635; 6 0,0.635; 7 1.27,-0.635; 8 1.27,0.635; 9 2.54,-0.635; 10 2.54,0.635
TACTILE_SWITCH_SMD_4.6X2.8MM = smd 0.9 x 1: 1 -2.05,-0.8; 2 2.05,-0.8; 3 2.05,0.8; 4 -2.05,0.8
PAD.03X.05 = smd 1.27 x 1.27: P$1 0,0
ARTEMIS_FP = smd 0.4 x 0.6: AD16 -4,-3.7; BOOT 1.5,4.5; D0 0.5,-4.5; D1 -0.5,-4.5; D2 -1,-3.7; D3 2,-3.7; D7 -1.5,4.5; D8 -0.5,4.5; D9 2,3.7; D10 1,3.7; D14 -5,3.7; D17 -3.5,-4.5; D36 2.5,-4.5; D38 3,-3.7; D40 2.5,4.5; D41 -2.5,-4.5; GND@1 4.5,4.5; GND@39 -5.5,-4.5; GND@47 -1.5,-4.5; GND@59 4.5,-4.5; RXI-0 3.5,4.5; SWDCK 4,3.7; SWDIO 0,3.7; TXO-0 0.5,4.5; ~AD31 -3,-3.7; ~AD35 -2,3.7; ~D4 -2.5,4.5; ~D5 -1,3.7; ~D18 -4.5,-4.5; ~D19 -5,-3.7; ~D22 -3.5,4.5; ~D23 -4,3.7; ~D24 -3,3.7; ~D27 -4.5,4.5; ~D28 -5.5,4.5; ~D37 3.5,-4.5; ~D39 3,3.7; ~D42 1.5,-4.5; ~D43 1,-3.7; ~D44 4,-3.7; ~D45 -2,-3.7; ~RST 0,-3.7 | smd 0.6 x 0.4: AD34 -6.5,-0.5; D15 -6.5,0.5; VDD@36 -5.7,-3; VDD@37 -6.5,-3.5; XI -6.5,-2.5; XO -5.7,-2; ~AD11 -5.7,-1; ~AD12 -5.7,2; ~AD13 -5.7,1; ~AD29 -6.5,-1.5; ~AD32 -5.7,3; ~AD33/SWO -5.7,0; ~D6 -6.5,3.5; ~D25 -6.5,2.5; ~D26 -6.5,1.5 | smd 0.6 x 0.6: GND@22 -6.5,4.5; GND@38 -6.5,-4.5
SOT23-5 = smd 0.55 x 1.2: 1 -0.95,-1.3; 2 0,-1.3; 3 0.95,-1.3; 4 0.95,1.3; 5 -0.95,1.3
MSOP10 = smd 1 x 0.3: 1 -2.25,1; 2 -2.25,0.5; 3 -2.25,0; 4 -2.25,-0.5; 5 -2.25,-1; 6 2.25,-1; 7 2.25,-0.5; 8 2.25,0; 9 2.25,0.5; 10 2.25,1
CRYSTAL-SMD-3.2X1.5MM = smd 1 x 1.8: P$1 -1.25,0; P$2 1.25,0

### Placement (x,y rotation side)
C1  11.43,5.08 180 bottom
C5  13.97,10.16 270 bottom
C6  16.51,7.49 180 bottom
C8  25.4,12.7 180 bottom
C9  25.4,7.62 180 bottom
C12  33.15,11.43 90 bottom
C13  38.1,11.43 270 bottom
C17  0.89,13.97 90 bottom
C18  6.35,13.97 270 bottom
C19  31.88,8.51 270 bottom
C20  8.89,13.97 180 bottom
C21  8.89,12.7 180 bottom
C22  34.8,8.13 180 bottom
C23  32.77,8.51 90 bottom
C28  8.89,16.76 0 bottom
D1  23.5,10.16 90 top
D2  17.78,10.16 90 top
D3  21.59,11.43 0 bottom
D4  21.59,8.89 0 bottom
D5  21.59,10.16 90 top
D6  15.88,10.16 90 top
D7  19.68,10.16 90 top
E1  11.43,2.54 0 bottom
FD1  42.55,2.54 0 top
FD2  0.76,19.56 0 top
FD3  0.64,17.14 0 bottom
FD4  42.55,2.54 0 bottom
FRAME1  2.54,-21.59 0 top  (outside the outline)
FRAME2  0,0 0 bottom
J1  3.45,4.47 90 top
J2  41.91,16.51 180 top
J3  21.59,4.95 0 top
J4  11.43,8.89 90 top
J5  16.51,3.81 180 top
J7  41.91,3.81 180 top
J9  26.67,1.27 0 top
J10  6.35,13.97 270 top
J11  28.07,10.16 270 top
J12  1.27,3.17 90 top
J13  13.97,19.05 0 top
J14  13.97,1.27 0 top
LOGO1  13.59,10.16 90 top
LOGO4  6.35,5.21 0 bottom
R1  8.89,8.89 0 bottom
R3  22.48,6.1 180 bottom
R5  16.51,12.83 180 bottom
R6  20.32,12.83 0 bottom
R10  16.51,14.1 180 bottom
R11  3.3,8.38 180 bottom
R12  22.48,7.49 180 bottom
R13  3.3,19.56 180 bottom
R14  8.89,15.24 0 bottom
R15  8.89,11.43 180 bottom
R16  20.32,14.1 0 bottom
R17  8.89,10.16 180 bottom
S1  10.16,18.8 180 top
TP1  29.97,8.26 0 bottom
TP2  30.73,10.41 0 bottom
TP3  23.62,13.21 0 bottom
TP4  30.1,12.7 0 bottom
TP5  3.56,9.91 0 bottom
TP6  1.27,11.3 0 bottom
U1  38.1,10.16 0 top
U2  16.51,10.16 0 bottom
U3  25.4,10.16 180 bottom
U6  3.3,13.97 270 bottom
U$1  [3V316]  19.81,15.11 0 top
U$2  [____GND____2]  24.51,1.27 0 bottom
U$3  [RST19]  17.4,15.11 0 top
U$4  [I#O3]  9.65,7.11 90 top
U$5  [CHG26]  17.78,11.3 90 top
U$6  [PWR27]  15.88,11.3 90 top
U$7  [GND17]  14.61,15.11 0 top
U$8  [QWIIC#LOGO#JPG]  21.59,6.5 0 top
U$9  [A00]  12.06,5.59 0 top
U$10  [A57]  36.2,5.59 0 bottom
U$11  [SCL30]  39.37,10.41 270 bottom
U$12  [A145]  31.62,14.73 0 bottom
U$13  [ARTEMIS6]  10.29,2.79 0 bottom
U$14  [MISO5]  31.75,14.48 270 bottom
U$15  [MIC0]  11.43,2.03 90 top
U$16  [MOSI4]  36.07,13.59 0 bottom
U$17  [NANO7]  9.14,1.27 0 bottom
U$18  [SCK3]  38.48,13.59 0 bottom
U$19  [A32]  31.11,5.59 0 bottom
U$20  [A00]  15.88,5.59 0 bottom
U$21  [A21]  28.57,5.59 0 bottom
U$22  [ARTEMIS6]  24.64,6.6 90 top
U$23  [I#O3]  13.21,7.24 0 bottom
U$24  [NANO7]  25.91,7.37 90 top
U$25  [PRODUCTION_INSTRUCTIONS]  49.53,50.8 0 top  (outside the outline)
U$26  [191]  23.5,11.43 90 top
U$27  [VIN19]  12.19,15.11 0 top
U$28  [A156]  28.96,14.73 0 bottom
U$29  [GND17]  13.34,12.95 0 bottom
U$30  [GND2]  23.37,1.27 0 bottom
U$31  [SDA31]  36.83,10.41 270 bottom
U$32  [46]  33.15,5.59 0 bottom
U$33  [GND17]  18.41,15.11 0 bottom
U$34  [A10]  18.29,5.59 0 bottom
U$35  [68]  38.1,5.59 0 bottom
U$36  [79]  40.64,5.59 0 bottom
U$37  [810]  43.18,5.59 0 bottom
U$38  [RST19]  20.7,15.11 0 bottom
U$39  [VIN19]  15.62,15.11 0 bottom
U$40  [A10]  14.86,5.59 0 top
U$41  [A21]  24.77,5.59 0 top
U$42  [A32]  27.3,5.59 0 top
U$43  [GND17]  9.65,9.53 90 top
U$45  [90]  43.18,14.73 0 bottom
U$46  [101]  40.89,14.73 0 bottom
U$47  [112]  38.35,14.73 0 bottom
U$48  [A167]  26.29,14.73 0 bottom
U$49  [3V316]  23.37,15.11 0 bottom
U$50  [RX10]  39.37,14.86 270 bottom
U$51  [RST1]  8.13,16.38 0 top
U$52  [123]  36.07,14.73 0 bottom
U$53  [134]  33.4,14.73 0 bottom
U$54  [A145]  27.05,14.86 0 top
U$55  [A156]  24.51,14.86 0 top
U$56  [A167]  21.84,14.86 0 top
U$57  [17#SDA21]  25.02,4.45 0 bottom
U$59  [TX12]  41.91,14.86 270 bottom
U$60  [18#SCL20]  24.89,2.92 0 bottom
U$85  [RX23]  21.59,11.43 90 top
U$86  [TX22]  19.68,11.43 90 top
Y2  35.56,11.43 0 bottom

### Tracks (layer width: path | path; a pad name or v marks a point on that pad's centre or on a via)
3.3V  (via drill 0.3)
  Top 0.152: J11.1 27.42,12.7 | J2.9 21.59,16.38 v20.32,15.11 | J3.2 21.09,3.87 v21.28,3.68
  Top 0.305: U1.VDD@36 32.02,7.16 31.6,6.74 U1.VDD@37 30.92,6.66 v30.73,6.48
  Route15 0.254: v21.28,3.68 24.32,6.73 v24.83,6.73
  Bottom 0.152: R14.2 6.77,15.24 C18.1 4.79,14.82 3.81,13.84 v3.81,13.21 v3.8,13.2 | R10.2 R16.2 20.32,14.95 v20.32,15.11 | C1.1 10.93,4.24 E1.5 10.68,3.84 11.21,3.31 11.86,3.31 E1.2 | U3.5 24.45,9.34 | J11.1 27.43,13.33 25.42,15.34 23.65,15.34 23.62,15.37 22.23,15.37 21.59,16 J2.9 | v3.8,13.2 U6.7 | C17.1 0.98,13.21 2.29,13.21 | 2.29,13.21 3.79,13.21 v3.8,13.2 | 2.29,13.21 2.3,13.19 U6.10
  Bottom 0.305: v30.73,6.48 30.73,6.87 C19.2 C23.1 33.83,8.01 C22.1 | v24.83,6.73 24.83,7.55 24.77,7.62 C9.1 24.77,7.49 24.51,7.49 | R12.2 24.51,7.49 | U3.5 24.45,7.55 24.51,7.49 | v10.16,4.83 v10.17,4.83 10.42,5.08 C1.1
  pour Route15 (isolate 0.203): 0,20.32 43.18,20.32 43.18,0 0,0
8
  Top 0.152: U1.D38 41.1,4.62 J7.1
10
  Top 0.152: U1.D40 40.6,15.28 J2.2
!RESET  (via drill 0.3)
  Top 0.152: S1.3 v9.78,18 S1.4 12.43,17.78 17.78,17.78 J2.10 | v38.48,7.37 38.1,6.99 U1.~RST | J11.10 28.7,7.61 27.99,6.89 26.88,6.89 25.81,7.95 25.81,12.22 26.67,13.08 v26.67,13.34
  Bottom 0.152: v9.78,18 9.74,17.96 C28.1 R14.1 C20.2 | J2.10 19.15,16.41 19.91,16.41 21.36,14.95 23.85,14.95 23.91,15.01 24.35,15.01 24.43,14.93 25.08,14.93 v26.67,13.34 | v38.48,7.37 38.63,7.52 38.63,9.11 38.32,9.42 37.24,9.42 37.22,9.4 33.3,9.4 33.16,9.54 31.48,9.54 31.35,9.4 31.35,8.23 30.5,7.39 29.61,7.39 29.39,7.62 J11.10
!RTS
  Bottom 0.152: 8.89,12.7 8.89,15.75 8.82,15.82 8.82,15.84 8.69,15.97 7.21,15.97 6.84,15.6 5.13,15.6 4.65,15.11 4.06,15.11 3.8,15.38 U6.4 | C20.1 C21.1 8.89,12.7 | R17.2 9.02,10.16 8.89,10.29 8.89,12.7
BOOT  (via drill 0.3)
  Top 0.152: U1.BOOT 39.6,13.23 40.13,12.7 v40.39,12.7
  Bottom 0.152: R15.2 C21.2 11,12.7 13.64,15.34 14.91,15.34 15.24,15.67 15.24,17.14 15.88,17.78 37.21,17.78 37.31,17.68 38,16.99 38,16.1 40.39,13.72 v40.39,12.7
CC1  (via drill 0.3)
  Top 0.152: J10.A5 4.34,15.22 3.43,16.13 3.43,17.91 v3.3,18.03
  Bottom 0.152: v3.3,18.03 4.15,18.88 R13.2
CC2  (via drill 0.3)
  Top 0.152: J10.B5 5.84,12.22 5.46,11.84 5.46,10.85 4.99,10.38 4.58,10.38 4.06,9.86 4.06,9.14 4.83,8.38 v5.21,8.38
  Bottom 0.152: R11.2 v5.21,8.38
D+1  (via drill 0.3)
  Top 0.152: J10.A6 5.71,14.22 5.46,13.97 | 5.46,13.97 5.46,13.46 5.7,13.22 J10.B6 | 5.46,13.97 v2.92,13.97
  Bottom 0.152: U6.1 2.3,14.59 v2.92,13.97
D-1  (via drill 0.3)
  Top 0.152: v3.34,14.73 3.35,14.72 J10.B7 7.12,14.72 7.37,14.48 7.37,13.97 7.11,13.72 J10.A7
  Bottom 0.152: U6.2 2.8,15.27 v3.34,14.73
GND  (via drill 0.3)
  Top 0.152: S1.1 12.76,19.05
  Top 0.406: J10.GND 6.99,17.68 v6.99,18.03
  Bottom 0.152: E1.6 12.06,1.56 12.06,1.8 11.69,2.17 11.45,2.17 E1.8 11.41,2.17 11.17,2.17 10.8,1.8 10.8,1.56 E1.7 10.8,1.52 10.8,1.28 11.17,0.91 11.41,0.91 E1.3 11.45,0.91 11.69,0.91 12.06,1.28 12.06,1.52 E1.6 | J14.1 13.7,1.54 12.86,1.54 12.82,1.51 12.38,1.51 12.35,1.54 E1.6 | R15.1 6.99,11.43 6.35,12.06 C18.2 | R5.1 15.66,12.79 v16.51,11.94 | U6.3 3.3,16.64 v2.79,17.14 2.54,17.14 | R13.1 2.45,17.23 2.54,17.14 | 2.54,17.14 2.03,17.14 0.89,16 C17.2
  Bottom 0.254: 33.6,10.03 v34.16,10.03
  Bottom 0.305: U3.2 25.39,11.47 25.39,12.06 25.9,12.57 C8.2
  Bottom 0.61: U2.2 16.51,8.34 16.73,8.12 16.73,8.07 17,7.8 17.05,7.8 C6.2
  Bottom 0.762: C12.1 33.28,10.45 33.28,10.31 33.58,10.01 33.6,10.03
  other vias: 32.38,6.48 34.8,7.24 42.55,7.24 42.55,9.02 42.55,13.08 39.37,10.79 12.7,4.7 15.24,5.97 11.43,6.22 4.32,6.73 18.41,7.37 19.05,4.57 30.73,14.1 30.48,4.57 6.99,9.78 25.4,13.46
  pour Top (isolate 0.203, rank 6): 0,0 43.18,0 43.18,20.32 0,20.32
  pour Bottom (isolate 0.203, rank 6): 0,0 43.18,0 43.18,20.32 0,20.32
  pour Route2 (isolate 0.203): 0,20.32 43.18,20.32 43.18,0 0,0
N$1
  Bottom 0.152: U2.5 17.46,12.73 R5.2
N$2  (via drill 0.3)
  Top 0.152: U1.XO 33.31,8.16 35.05,9.91 v35.05,10.03
  Bottom 0.152: v35.05,10.03 35.07,10.05 35.07,10.67 Y2.P$2 34,11.43 C12.2
N$3  (via drill 0.3)
  Top 0.152: D2.C 18.37,11.62 v18.37,12.83
  Bottom 0.152: v18.37,12.83 R6.2
N$4
  Bottom 0.152: U2.1 17.69,8.86 18.45,8.1 18.89,8.1 19.2,8.41 19.2,8.95 21.17,10.92 R6.1
N$5  (via drill 0.3)
  Top 0.152: D7.A 19.68,9.8 18.96,10.53 18.96,11.84 v18.92,11.87
  Bottom 0.152: v18.92,11.87 19.15,12.1 20.11,12.1 20.39,12.38 20.39,13.42 21.07,14.1 R16.1
N$7  (via drill 0.3)
  Top 0.152: v20.57,6.1 22.05,6.1 23.5,7.54 D1.A
  Bottom 0.152: R3.1 v20.57,6.1
N$8  (via drill 0.3)
  Top 0.152: U1.XI 33.26,7.66 33.56,7.96 34.76,7.96 v36.83,10.03
  Bottom 0.152: v36.83,10.03 36.81,10.05 36.81,11.3 | 36.81,11.3 Y2.P$1 | C13.2 37.38,11.3 36.81,11.3
N$9  (via drill 0.3)
  Top 0.152: v20.57,7.37 21.59,8.38 D5.A
  Bottom 0.152: R12.1 20.7,7.49 v20.57,7.37
N$10  (via drill 0.3)
  Top 0.152: v14.48,13.46 14.48,9.78 14.99,9.27 15.86,9.27 D6.A
  Bottom 0.152: R10.1 15.11,14.1 v14.48,13.46
PDMCLK  (via drill 0.3)
  Top 0.152: U1.~D37 v41.6,7.11 | v12.6,2.04 12.6,2.29 12.11,2.79 10.41,2.79 v9.27,1.65
  Bottom 0.152: v41.6,7.11 41.6,6.04 40.51,4.95 40.51,4.32 40.54,4.29 40.54,3.33 39.85,2.64 39.65,2.44 17.5,2.44 17.4,2.54 13.1,2.54 v12.6,2.04 | v9.27,1.65 10.46,2.84 E1.4
PDMDATA  (via drill 0.3)
  Top 0.152: U1.D36 40.54,5.6 40.54,3.33 39.85,2.64 39.65,2.44 25.15,2.44 25.09,2.51 13.14,2.51 11.81,3.84 v11.43,3.84
  Bottom 0.152: E1.1 v11.43,3.84
RXI-0  (via drill 0.3)
  Top 0.152: v6.1,7.87 6.86,7.87 v8.26,6.48 | D5.C 20.83,10.28 20.83,8.13 20.6,7.9 20.35,7.9 18.16,5.71 v18.16,5.33 | U1.RXI-0 41.6,9.85 40.64,8.89 v37.72,8.89
  Bottom 0.152: U6.8 3.3,10.16 TP5.P$1 3.56,9.16 3.37,8.98 3.37,7.79 3.67,7.49 5.71,7.49 v6.1,7.87 | v37.72,8.89 37.47,8.64 37.47,5.97 37.02,5.52 24.13,5.52 23.97,5.37 22.7,5.37 21.61,4.27 19.75,4.27 19.52,4.04 18.44,4.04 18.16,4.32 v18.16,5.33 12.7,5.33 12.43,5.61 9.12,5.61 v8.26,6.48
SHLD  (via drill 0.3)  (5 unrouted)
  other vias: 5.46,16.26 5.21,12.45
  pour Top (isolate 0.203): 0,9.65 6.22,9.65 6.22,20.32 0,20.32
  pour Bottom (isolate 0.203): 0,9.65 6.22,9.65 6.22,20.32 0,20.32
SWDCK  (via drill 0.3, 0.38)
  Top 0.152: v24.38,4.83 24.38,5 24.66,5.28 28.17,5.28 29.03,6.15 29.03,6.92 29.43,7.32 29.43,9.24 v29.72,9.53 | v38.1,8.13 38.23,8.26 40.51,8.26 42.01,9.75 42.01,13.3 42.1,13.39 U1.SWDCK
  Bottom 0.152: 29.94,8.29 TP1.P$1 29.97,9.27 v29.72,9.53 29.72,10.41 J11.4 | v38.1,8.13 37.85,7.87 37.85,5.69 37.38,5.22 24.78,5.22 v24.38,4.83
SWDIO  (via drill 0.3)
  Top 0.152: v35.56,12.52 35.91,12.17 37.3,12.17 38.1,12.96 U1.SWDIO
  Bottom 0.152: v35.56,12.52 35.51,12.57 34.36,12.57 33.85,13.08 33.82,13.06 32.55,13.06 31.33,11.84 30.73,11.84 | J11.2 28.88,12.7 29.74,11.84 30.73,11.84 | TP2.P$1 30.73,11.84
TXO-0  (via drill 0.3)
  Top 0.152: U1.TXO-0 38.6,14.99 38,15.6 38,16.99 37.21,17.78 23.75,17.78 22.96,16.99 22.78,16.81 22.78,14.65 22.96,14.48 22.96,13.97 22.48,13.49 19.68,13.49 | 19.68,13.49 D7.C | v2.15,10.55 2.16,10.56 2.16,17.65 2.54,18.03 2.55,18.03 3.53,19.02 4.46,19.02 v5.21,19.76 | v11.43,16.51 12.49,15.45 13.24,15.45 15.21,13.49 19.68,13.49
  Bottom 0.152: TP6.P$1 1.31,11.3 1.42,11.19 2.16,11.19 | 2.16,11.19 2.67,11.19 2.8,11.32 U6.9 | v2.15,10.55 2.16,10.56 2.16,11.19 | v11.43,16.51 11.43,18.16 9.78,19.81 5.26,19.81 v5.21,19.76
V_BATT
  Top 0.762: J12.2 1.51,5.47 J1.2
  Bottom 0.762: J12.2 5.38,5.71 7.09,7.42 14.32,7.42 14.39,7.49 C6.1 | U2.3 15.56,7.59 C6.1 | D4.A 20.45,8.68 19.25,7.49 19.25,7.02 18.58,6.35 16.38,6.35 15.66,7.07 C6.1
V_USB  (via drill 0.3)
  Top 0.152: D2.A 18.02,9.28 v18.67,8.64
  Top 0.61: J10.VBUS1 7.71,16.42 | 7.37,11.52 J10.VBUS2
  Top 0.762: 7.71,16.42 8,16.13 8,14.84 | 8,14.84 12.98,14.84 13.55,14.28 13.55,12.45 v13.59,12.45 | 8,14.84 8,12.15 7.37,11.52
  Bottom 0.152: v18.67,8.64 18.67,9.99
  Bottom 0.762: v13.59,12.45 13.97,12.06 C5.1 14.06,10.92 15.56,10.92 | D3.A 20.44,11.05 19.38,9.99 18.67,9.99 16.26,9.99 15.56,10.69 15.56,10.92 | U2.4 15.56,10.92
VIN  (via drill 0.3)
  Top 0.152: v11.19,13.72 9.4,13.72 8.7,13.02 8.7,10.35 v6.86,8.51
  Top 0.762: J2.12 16.26,14.22 v22.35,14.22
  Bottom 0.152: v11.19,13.72 13.97,16.5 J2.12 | R1.2 7.66,8.51 v6.86,8.51
  Bottom 0.508: 24.46,11.47 24.46,12.28 24.88,12.7 C8.1
  Bottom 0.762: 24.46,11.47 U3.1 24.17,11.18 22.99,11.18 D3.C | D4.C D3.C | D3.C 22.35,11.82 v22.35,14.22
VREG_EN  (via drill 0.3)
  Top 0.152: v24.19,10.16 23.11,10.16 22.61,9.65 22.61,7.11 22.04,6.54 20.88,6.54 20.8,6.63 20.34,6.63 18.51,4.8 17.8,4.8 15.98,6.63 14.84,6.63 13.44,8.03 13.44,8.4 12.95,8.89 J4.1
  Bottom 0.152: U3.3 26.35,10.57 25.94,10.16 v24.19,10.16 | R1.1 J4.1
~4
  Top 0.152: U1.~D18 33.6,5.15 32.26,3.81 J7.5
~6  (via drill 0.3)
  Top 0.152: U1.~D43 39.1,7.1 39.62,7.62 v40.26,7.62
  Bottom 0.152: v40.26,7.62 39.17,6.53 39.17,6.15 J7.3
~7
  Top 0.152: U1.~D42 39.6,3.81 J7.2
~9
  Top 0.152: U1.~D39 41.1,15.7 J2.1
~11
  Top 0.152: U1.~D5 37.1,16.24 J2.3
~12
  Top 0.152: U1.D7 34.75,16.51 J2.4
~13
  Top 0.152: J2.5 32.13,16.13 32.13,13.94 31.85,13.66 U1.~D6
~A0  (via drill 0.3)
  Top 0.152: U1.~AD13 32.33,11.23 31.2,11.23 31.07,11.37 28.2,14.25 25.34,14.25 24.6,13.51 22.93,13.51 22.6,13.18 21.57,13.18 20.41,12.03 20.41,8.35 20.27,8.2 20.23,8.2 19.96,7.94 14.29,7.94 v13.97,8.26 | v12.83,8.26 12.83,8.21 13.97,7.07 J5.2
  Bottom 0.152: v12.83,8.26 v13.97,8.26
~A1
  Top 0.152: U1.~AD33/SWO 30.48,10.16 | 30.48,10.16 J11.6 | J5.1 17.48,2.85 24.94,2.85 25.27,3.17 25.27,4.57 25.68,4.98 28.3,4.98 28.6,5.28 28.95,5.28 29.34,5.67 29.34,6.7 30.18,7.54 30.18,8.89 30.48,9.19 30.48,10.16
~A2
  Top 0.152: J7.7 27.56,3.81 28.73,4.98 29.11,4.98 29.64,5.51 29.64,6.57 30.48,7.41 30.48,8.76 30.88,9.16 U1.~AD11
~A3
  Top 0.152: U1.~AD29 30.89,8.66 30.8,8.57 30.8,7.29 29.95,6.44 29.95,5.18 29.21,4.45 J7.6
~A5
  Top 0.152: U1.~AD31 35.1,4.62 J7.4
~A14  (via drill 0.3)
  Top 0.152: U1.~AD35 36.1,13.3 v36.58,12.83
  Bottom 0.152: v36.58,12.83 36.58,14.35 35.69,15.24 30.48,15.24 J2.6
~A15
  Top 0.152: U1.~AD32 30.63,13.16 28.45,15.34 27.84,15.34 J2.7
~A16
  Top 0.152: U1.~AD12 32.33,12.23 30.64,12.23 28.32,14.55 25.05,14.55 24.44,13.95 23.4,13.95 23.34,14 23.34,16.1 23.75,16.51 J2.8
~D19/LED  (via drill 0.3)
  Top 0.152: U1.~D19 33.1,6.74 v33.53,7.17
  Bottom 0.152: R3.2 23.58,5.84 30.93,5.84 32.26,7.17 v33.53,7.17
~D25/SDA2  (via drill 0.3)
  Top 0.152: U1.~D25 30.65,12.66 28.45,14.86 24.42,14.86 24.13,14.57 v24.13,14.48 | J3.3 22.09,5.71 24.99,8.6 24.99,11.46 24.38,12.06 v23.62,12.06
  Bottom 0.152: v24.13,14.48 23.62,13.97 TP3.P$1 v23.62,12.06
~D27/SCL2  (via drill 0.3)
  Top 0.152: U1.~D27 33.6,13.52 34.02,13.1 v34.66,13.1 | J3.4 23.09,5.82 25.51,8.24 25.51,12.35 26.14,12.98 26.14,13.56 26.45,13.87 27.66,13.87 v27.94,13.59
  Bottom 0.152: v34.66,13.1 34.27,13.48 30.1,13.48 | v27.94,13.59 28.05,13.48 30.1,13.48 | TP4.P$1 30.1,13.48

### Text on the board
Bottom: x02
bValues: DNP
Measures: Units in inches
tDocu: Four-layer board | 0.8mm Thickness | N. Seidle